# Altium schematic sheet ParteAnalogicaMedicion.SchDoc: Etapa de entrada alterna
size A4; Address1: Medidor de energia PROSER; Address2: MEI-300V; DocumentNumber: 4; Revision: 01; SheetNumber: 4; SheetTotal: 6
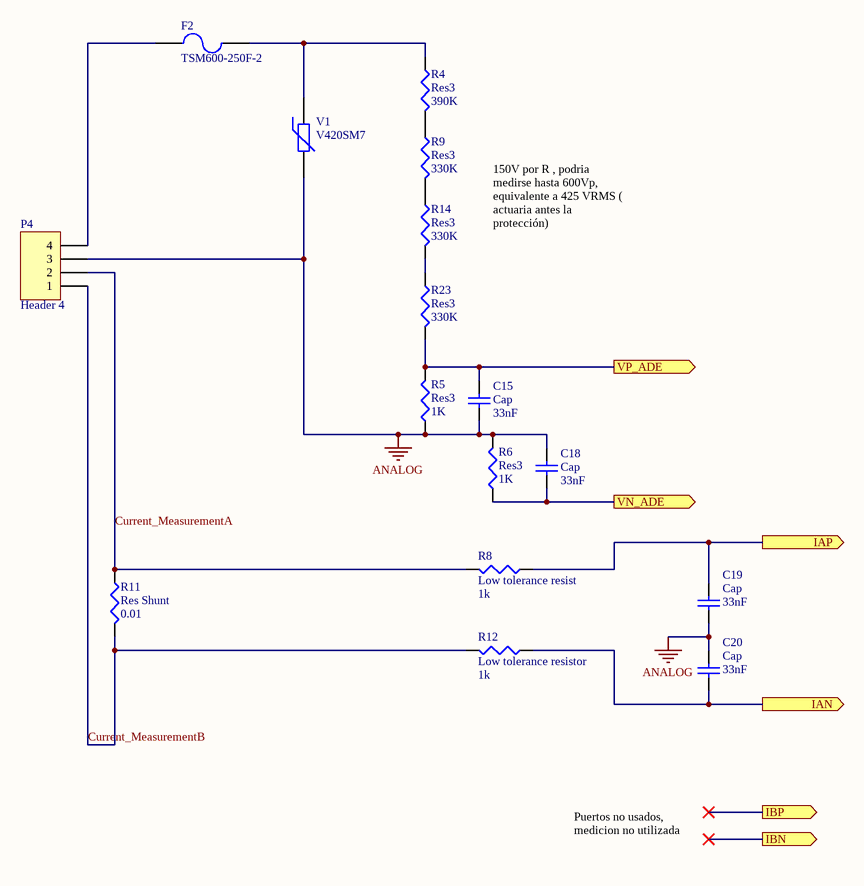
[diagram p0: ParteAnalogicaMedicion.SchDoc]

## Parts
C15  Cap  value 33nF  [Custom0805]
C18  Cap  value 33nF  [Custom0805]
C19  Cap  value 33nF  [Custom0805]
C20  Cap  value 33nF  [Custom0805]
F2  TSM600-250F-2  [*SOIC254P1016X440-4N]
P4  Header 4  [ConectorPrsr]
R4  Res3  value 390K  [Custom0805]
R5  Res3  value 1K  [Custom0805]
R6  Res3  value 1K  [Custom0805]
R8  Low tolerance resist  value 1k  [Custom0805]
R9  Res3  value 330K  [Custom0805]
R11  Res Shunt  value 0.01  [RESC1000X525X52L180M]
R12  Low tolerance resistor  value 1k  [Custom0805]
R14  Res3  value 330K  [Custom0805]
R23  Res3  value 330K  [C0805]
V1  V420SM7  [PCBComponent_1]

## Ports
IAN (out), IAP (out), IBN (out), IBP (out), VN_ADE (out), VP_ADE (out)

## Nets
ANALOG: C15.1 C18.2 C19.1 C20.2 P4.3 R5.1 R6.2 V1.2
Current_MeasurementA: P4.2 R8.2 R11.1
Current_MeasurementB: P4.1 R11.2 R12.2
IAN: C20.1 R12.1 ; port IAN
IAP: C19.2 R8.1 ; port IAP
VN_ADE: C18.1 R6.1 ; port VN_ADE
VP_ADE: C15.2 R5.2 R23.2 ; port VP_ADE
NetF2_1: F2.1 P4.4
NetF2_2: F2.2 R4.1 V1.1
NetR4_2: R4.2 R9.1
NetR9_2: R9.2 R14.1
NetR14_2: R14.2 R23.1

## Notes on the sheet
- 150V por R , podria medirse hasta 600Vp, equivalente a 425 VRMS ( actuaria antes la protección)
- Puertos no usados, medicion no utilizada
- Title
- Size:
- Date:
- A4
- Number:
- Time:
- Revision:
- Sheet
- of
- File:

## Library data of the parts
C15 C18-C20 = Cap: Capacitor; Published: 8-Jun-2000; LatestRevisionDate: 17-Jul-2002; LatestRevisionNote: Re-released for DXP Platform.; PackageReference: RAD-0.3; Publisher: Altium Limited; PackageDescription: Radial Cap, Thru-Hole; 2 Leads; 0.3 in Pin Spacing
F2 = Fuse 2: Fuse; Published: 8-Jun-2000; LatestRevisionDate: 17-Jul-2002; LatestRevisionNote: Re-released for DXP Platform.; PackageReference: PIN-W2/E2.8; Publisher: Altium Limited; PackageDescription: Thru-Hole; 2 Leads
P4 = Header 4: Header, 4-Pin; LatestRevisionDate: 17-Jul-2002; LatestRevisionNote: Re-released for DXP Platform.; Publisher: Altium Limited
R4-R6 R8 R9 R11 R12 R14 R23 = Res3: Resistor; Published: 8-Jun-2000; LatestRevisionDate: 29-May-2009; LatestRevisionNote: IPC-7351 Footprint Added.; PackageReference: J1-0603; Publisher: Altium Limited; PackageDescription: Chip Resistor
V1 = Res Varistor: Varistor (Voltage-Sensitive Resistor); Published: 24-Mar-1999; LatestRevisionDate: 29-May-2009; LatestRevisionNote: IPC-7351 Footprint Added.; PackageVersion: Mar-2003; PackageReference: 6-0805; Publisher: Altium Limited; PackageDescription: Chip Resistor 0805 Case Size; Code_IPC: RESC2012